# EAGLE design Input_v1.0 (EAGLE 9.6.1)

## Sheet 1 of 2
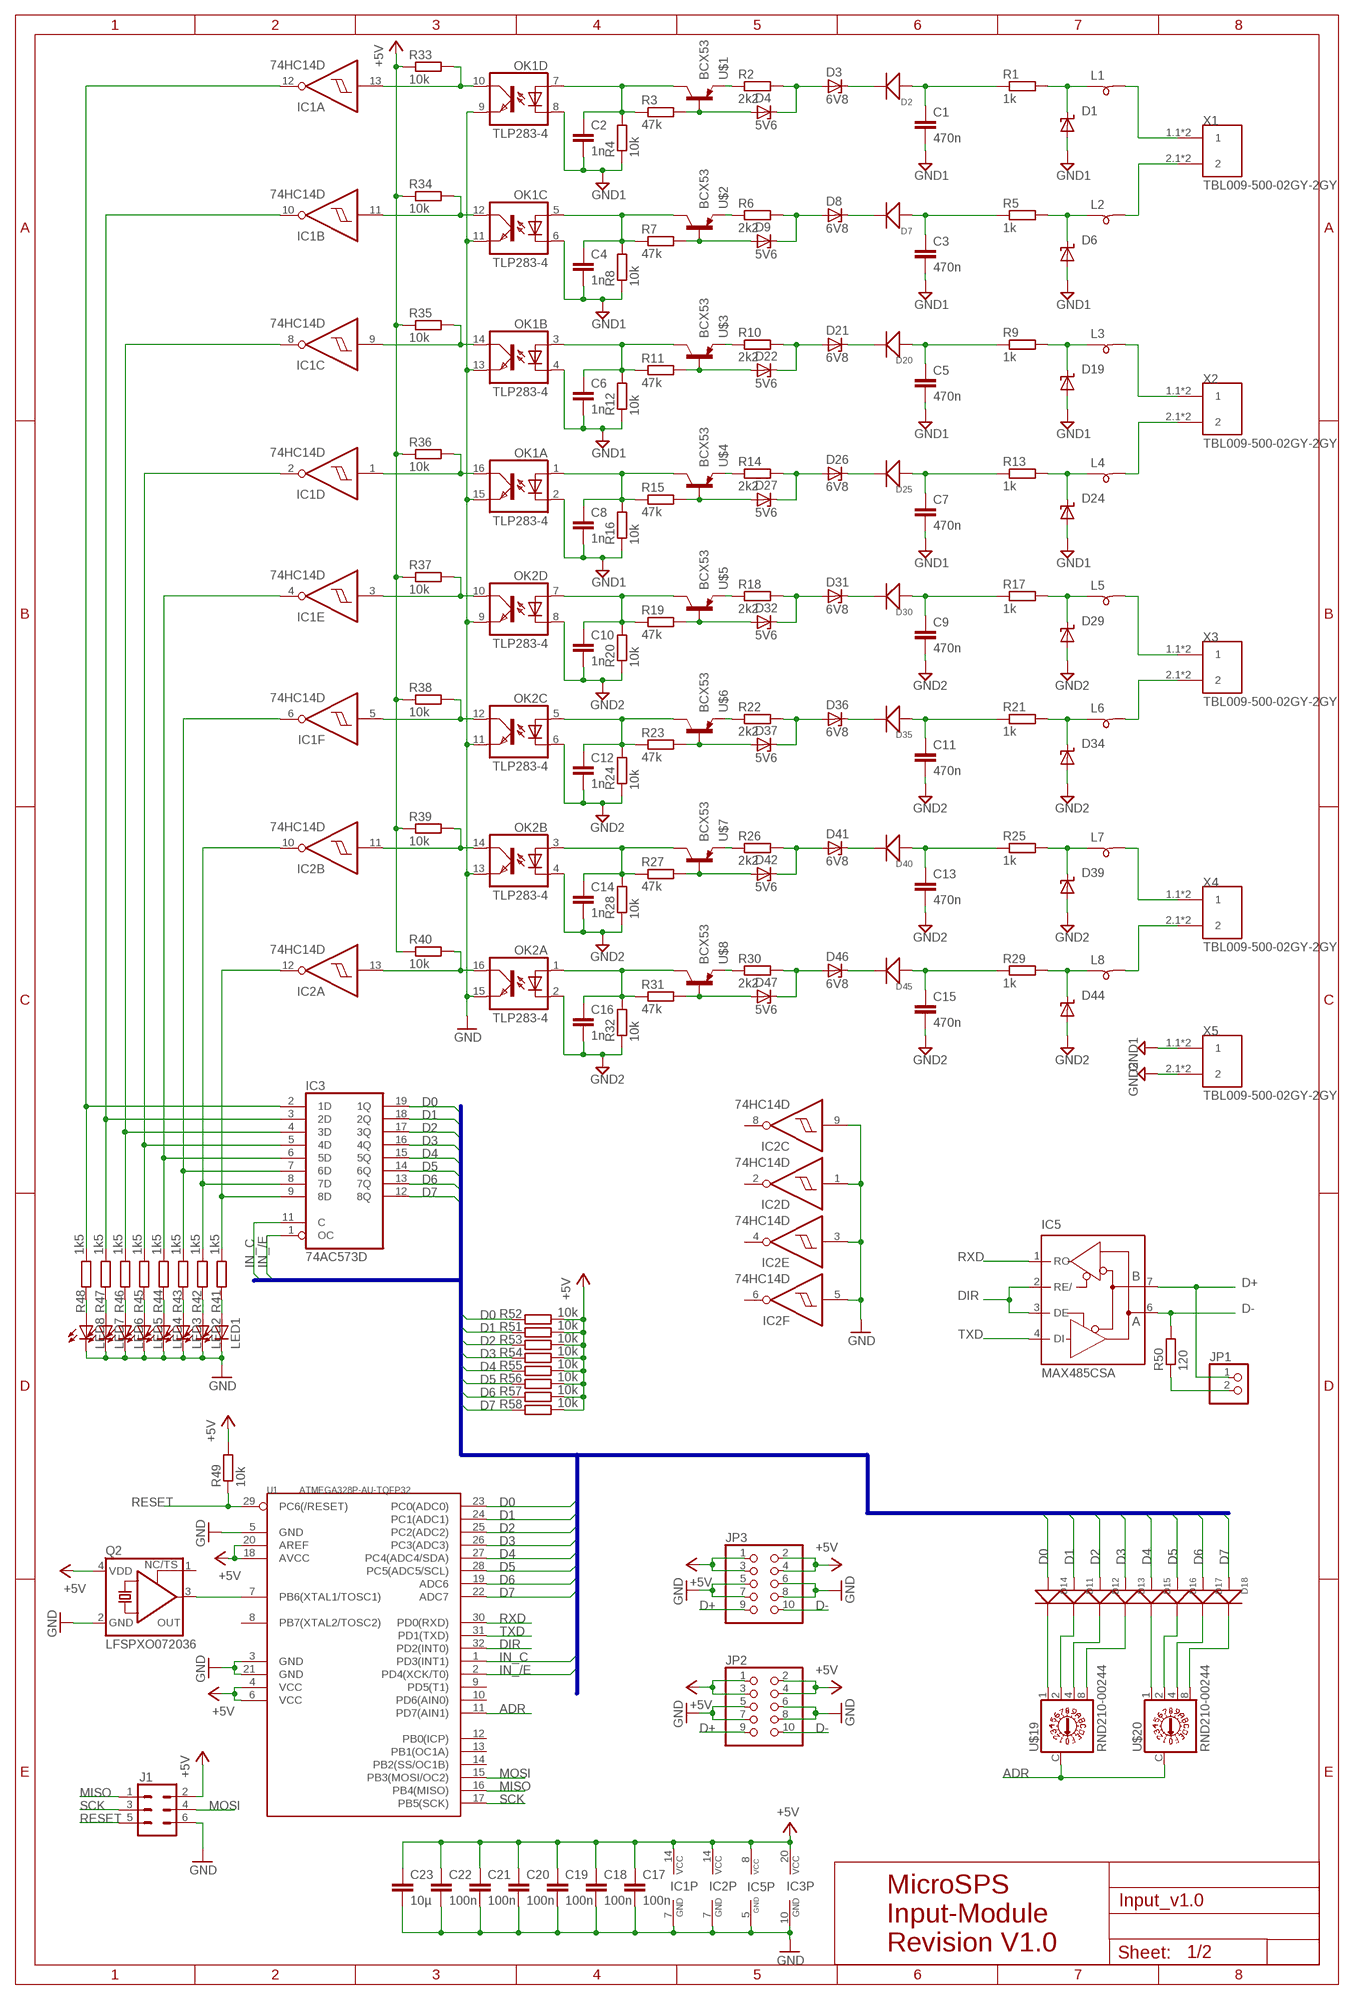
[diagram p0: schematic, sheet 1]

### Parts
C1  470n  C-EUC0805  [C0805]
C2  1n  C-EUC0805  [C0805]
C3  470n  C-EUC0805  [C0805]
C4  1n  C-EUC0805  [C0805]
C5  470n  C-EUC0805  [C0805]
C6  1n  C-EUC0805  [C0805]
C7  470n  C-EUC0805  [C0805]
C8  1n  C-EUC0805  [C0805]
C9  470n  C-EUC0805  [C0805]
C10  1n  C-EUC0805  [C0805]
C11  470n  C-EUC0805  [C0805]
C12  1n  C-EUC0805  [C0805]
C13  470n  C-EUC0805  [C0805]
C14  1n  C-EUC0805  [C0805]
C15  470n  C-EUC0805  [C0805]
C16  1n  C-EUC0805  [C0805]
C17  100n  C-EUC0805  [C0805]
C18  100n  C-EUC0805  [C0805]
C19  100n  C-EUC0805  [C0805]
C20  100n  C-EUC0805  [C0805]
C21  100n  C-EUC0805  [C0805]
C22  100n  C-EUC0805  [C0805]
C23  10µ  C-EUC0805  [C0805]
D1  SUPPRESSOR-SMBJ  [SMBJ]
D2  DIODE'1N4148-SMD'  [LL-34]
D3  6V8  ZENER-DIODESOD80C  [SOD80C]
D4  5V6  ZENER-DIODESOD80C  [SOD80C]
D6  SUPPRESSOR-SMBJ  [SMBJ]
D7  DIODE'1N4148-SMD'  [LL-34]
D8  6V8  ZENER-DIODESOD80C  [SOD80C]
D9  5V6  ZENER-DIODESOD80C  [SOD80C]
D11  DIODE'1N4148-SMD'  [LL-34]
D12  DIODE'1N4148-SMD'  [LL-34]
D13  DIODE'1N4148-SMD'  [LL-34]
D14  DIODE'1N4148-SMD'  [LL-34]
D15  DIODE'1N4148-SMD'  [LL-34]
D16  DIODE'1N4148-SMD'  [LL-34]
D17  DIODE'1N4148-SMD'  [LL-34]
D18  DIODE'1N4148-SMD'  [LL-34]
D19  SUPPRESSOR-SMBJ  [SMBJ]
D20  DIODE'1N4148-SMD'  [LL-34]
D21  6V8  ZENER-DIODESOD80C  [SOD80C]
D22  5V6  ZENER-DIODESOD80C  [SOD80C]
D24  SUPPRESSOR-SMBJ  [SMBJ]
D25  DIODE'1N4148-SMD'  [LL-34]
D26  6V8  ZENER-DIODESOD80C  [SOD80C]
D27  5V6  ZENER-DIODESOD80C  [SOD80C]
D29  SUPPRESSOR-SMBJ  [SMBJ]
D30  DIODE'1N4148-SMD'  [LL-34]
D31  6V8  ZENER-DIODESOD80C  [SOD80C]
D32  5V6  ZENER-DIODESOD80C  [SOD80C]
D34  SUPPRESSOR-SMBJ  [SMBJ]
D35  DIODE'1N4148-SMD'  [LL-34]
D36  6V8  ZENER-DIODESOD80C  [SOD80C]
D37  5V6  ZENER-DIODESOD80C  [SOD80C]
D39  SUPPRESSOR-SMBJ  [SMBJ]
D40  DIODE'1N4148-SMD'  [LL-34]
D41  6V8  ZENER-DIODESOD80C  [SOD80C]
D42  5V6  ZENER-DIODESOD80C  [SOD80C]
D44  SUPPRESSOR-SMBJ  [SMBJ]
D45  DIODE'1N4148-SMD'  [LL-34]
D46  6V8  ZENER-DIODESOD80C  [SOD80C]
D47  5V6  ZENER-DIODESOD80C  [SOD80C]
IC1  74HC14D  [SO14]
IC2  74HC14D  [SO14]
IC3  74AC573D  [SO20W]
IC5  MAX485CSA  MAX481CSA  [SO08]
J1  CONN_03X2FEMALE_SMD  [2X3_SMD]
JP1  PINHD-1X2  [1X02]
JP2  PINHD-2X5/90  [2X05/90]
JP3  PINHD-2X5/90  [2X05/90]
L1  SM-B5  [SM-B5]
L2  SM-B5  [SM-B5]
L3  SM-B5  [SM-B5]
L4  SM-B5  [SM-B5]
L5  SM-B5  [SM-B5]
L6  SM-B5  [SM-B5]
L7  SM-B5  [SM-B5]
L8  SM-B5  [SM-B5]
LED1  LED3MM  [LED3MM]
LED2  LED3MM  [LED3MM]
LED3  LED3MM  [LED3MM]
LED4  LED3MM  [LED3MM]
LED5  LED3MM  [LED3MM]
LED6  LED3MM  [LED3MM]
LED7  LED3MM  [LED3MM]
LED8  LED3MM  [LED3MM]
OK1  TLP283-4  [MINI-FLAT-16]
OK2  TLP283-4  [MINI-FLAT-16]
Q2  LFSPXO072036  KXO-PXO/XO-56-56  [5.0X3.2_KXO-56]
R1  1k  R-EU_R0805  [R0805]
R2  2k2  R-EU_R0805  [R0805]
R3  47k  R-EU_R0805  [R0805]
R4  10k  R-EU_R0805  [R0805]
R5  1k  R-EU_R0805  [R0805]
R6  2k2  R-EU_R0805  [R0805]
R7  47k  R-EU_R0805  [R0805]
R8  10k  R-EU_R0805  [R0805]
R9  1k  R-EU_R0805  [R0805]
R10  2k2  R-EU_R0805  [R0805]
R11  47k  R-EU_R0805  [R0805]
R12  10k  R-EU_R0805  [R0805]
R13  1k  R-EU_R0805  [R0805]
R14  2k2  R-EU_R0805  [R0805]
R15  47k  R-EU_R0805  [R0805]
R16  10k  R-EU_R0805  [R0805]
R17  1k  R-EU_R0805  [R0805]
R18  2k2  R-EU_R0805  [R0805]
R19  47k  R-EU_R0805  [R0805]
R20  10k  R-EU_R0805  [R0805]
R21  1k  R-EU_R0805  [R0805]
R22  2k2  R-EU_R0805  [R0805]
R23  47k  R-EU_R0805  [R0805]
R24  10k  R-EU_R0805  [R0805]
R25  1k  R-EU_R0805  [R0805]
R26  2k2  R-EU_R0805  [R0805]
R27  47k  R-EU_R0805  [R0805]
R28  10k  R-EU_R0805  [R0805]
R29  1k  R-EU_R0805  [R0805]
R30  2k2  R-EU_R0805  [R0805]
R31  47k  R-EU_R0805  [R0805]
R32  10k  R-EU_R0805  [R0805]
R33  10k  R-EU_R0805  [R0805]
R34  10k  R-EU_R0805  [R0805]
R35  10k  R-EU_R0805  [R0805]
R36  10k  R-EU_R0805  [R0805]
R37  10k  R-EU_R0805  [R0805]
R38  10k  R-EU_R0805  [R0805]
R39  10k  R-EU_R0805  [R0805]
R40  10k  R-EU_R0805  [R0805]
R41  1k5  R-EU_R0805  [R0805]
R42  1k5  R-EU_R0805  [R0805]
R43  1k5  R-EU_R0805  [R0805]
R44  1k5  R-EU_R0805  [R0805]
R45  1k5  R-EU_R0805  [R0805]
R46  1k5  R-EU_R0805  [R0805]
R47  1k5  R-EU_R0805  [R0805]
R48  1k5  R-EU_R0805  [R0805]
R49  10k  R-EU_R0805  [R0805]
R50  120  R-EU_R0805  [R0805]
R51  10k  R-EU_R0805  [R0805]
R52  10k  R-EU_R0805  [R0805]
R53  10k  R-EU_R0805  [R0805]
R54  10k  R-EU_R0805  [R0805]
R55  10k  R-EU_R0805  [R0805]
R56  10k  R-EU_R0805  [R0805]
R57  10k  R-EU_R0805  [R0805]
R58  10k  R-EU_R0805  [R0805]
U1  ATMEGA328P-AU-TQFP32  MCU-ATMEGA328P-AU(TQFP32)  [TQFP32-0.8-7X7MM]
U$1  BCX53  [SOT89]
U$2  BCX53  [SOT89]
U$3  BCX53  [SOT89]
U$4  BCX53  [SOT89]
U$5  BCX53  [SOT89]
U$6  BCX53  [SOT89]
U$7  BCX53  [SOT89]
U$8  BCX53  [SOT89]
U$19  RND210-00244  [RND210-00244]
U$20  RND210-00244  [RND210-00244]
X1  TBL009-500-02GY-2GY  [TBL009-500-02GY-2GY]
X2  TBL009-500-02GY-2GY  [TBL009-500-02GY-2GY]
X3  TBL009-500-02GY-2GY  [TBL009-500-02GY-2GY]
X4  TBL009-500-02GY-2GY  [TBL009-500-02GY-2GY]
X5  TBL009-500-02GY-2GY  [TBL009-500-02GY-2GY]

### Nets
+5V: C17.1 C18.1 C19.1 C20.1 C21.1 C22.1 C23.1 IC1.14(P:VCC) IC2.14(P:VCC) IC3.20(VCC) IC5.8(VCC) J1.2 JP2.1 JP2.2 JP2.3 JP2.4 JP3.1 JP3.2 JP3.3 JP3.4 Q2.4(VDD) R33.1 R34.1 R35.1 R36.1 R37.1 R38.1 R39.1 R40.1 R49.2 R51.2 R52.2 R53.2 R54.2 R55.2 R56.2 R57.2 R58.2 U1.4(VCC) U1.6(VCC) U1.18(AVCC) U1.20(AREF)
ADR: U1.11(PD7(AIN1)) U$19.C U$20.C
D0: D14.A(+) IC3.19(1Q) R52.1 U1.23(PC0(ADC0))
D1: D11.A(+) IC3.18(2Q) R51.1 U1.24(PC1(ADC1))
D2: D12.A(+) IC3.17(3Q) R53.1 U1.25(PC2(ADC2))
D3: D13.A(+) IC3.16(4Q) R54.1 U1.26(PC3(ADC3))
D4: D15.A(+) IC3.15(5Q) R55.1 U1.27(PC4(ADC4/SDA))
D5: D16.A(+) IC3.14(6Q) R56.1 U1.28(PC5(ADC5/SCL))
D6: D17.A(+) IC3.13(7Q) R57.1 U1.19(ADC6)
D7: D18.A(+) IC3.12(8Q) R58.1 U1.22(ADC7)
D+: IC5.7(B) JP1.1 JP2.9 JP3.9
D-: IC5.6(A) JP2.10 JP3.10 R50.2
DIR: IC5.2(RE/) IC5.3(DE) U1.32(PD2(INT0))
GND: C17.2 C18.2 C19.2 C20.2 C21.2 C22.2 C23.2 IC1.7(P:GND) IC2.1(D:I) IC2.3(E:I) IC2.5(F:I) IC2.7(P:GND) IC2.9(C:I) IC3.10(GND) IC5.5(GND) J1.6 JP2.5 JP2.6 JP2.7 JP2.8 JP3.5 JP3.6 JP3.7 JP3.8 LED1.K(C) LED2.K(C) LED3.K(C) LED4.K(C) LED5.K(C) LED6.K(C) LED7.K(C) LED8.K(C) OK1.9(D:EMIT) OK1.11(C:EMIT) OK1.13(B:EMIT) OK1.15(A:EMIT) OK2.9(D:EMIT) OK2.11(C:EMIT) OK2.13(B:EMIT) OK2.15(A:EMIT) Q2.2(GND) U1.3(GND) U1.5(GND) U1.21(GND)
GND1: C1.2 C2.2 C3.2 C4.2 C5.2 C6.2 C7.2 C8.2 D1.A D6.A D19.A D24.A OK1.2(A:C) OK1.4(B:C) OK1.6(C:C) OK1.8(D:C) R4.1 R8.1 R12.1 R16.1 X5.1.1 X5.1.2
GND2: C9.2 C10.2 C11.2 C12.2 C13.2 C14.2 C15.2 C16.2 D29.A D34.A D39.A D44.A OK2.2(A:C) OK2.4(B:C) OK2.6(C:C) OK2.8(D:C) R20.1 R24.1 R28.1 R32.1 X5.2.1 X5.2.2
IN_/E: IC3.1(OC) U1.2(PD4(XCK/T0))
IN_C: IC3.11(C) U1.1(PD3(INT1))
MISO: J1.1 U1.16(PB4(MISO))
MOSI: J1.4 U1.15(PB3(MOSI/OC2))
N$1: D3.A D4.C R2.2
N$2: D2.C(-) D3.C
N$3: C1.1 D2.A(+) R1.1
N$4: D1.C L1.1 R1.2
N$5: D4.A R3.2 U$1.1(B)
N$6: R2.1 U$1.3(E)
N$7: C2.1 OK1.7(D:A) R3.1 R4.2 U$1.2(C) U$1.2.1(C)
N$8: IC1.13(A:I) OK1.10(D:COL) R33.2
N$9: L1.2 X1.1.1 X1.1.2
N$10: D8.A D9.C R6.2
N$11: D7.C(-) D8.C
N$12: C3.1 D7.A(+) R5.1
N$13: D6.C L2.1 R5.2
N$14: R6.1 U$2.3(E)
N$15: L2.2 X1.2.1 X1.2.2
N$16: D9.A R7.2 U$2.1(B)
N$17: C4.1 OK1.5(C:A) R7.1 R8.2 U$2.2(C) U$2.2.1(C)
N$18: IC1.11(B:I) OK1.12(C:COL) R34.2
N$19: D21.A D22.C R10.2
N$20: D20.C(-) D21.C
N$21: C5.1 D20.A(+) R9.1
N$22: D19.C L3.1 R9.2
N$23: R10.1 U$3.3(E)
N$24: L3.2 X2.1.1 X2.1.2
N$25: D22.A R11.2 U$3.1(B)
N$26: C6.1 OK1.3(B:A) R11.1 R12.2 U$3.2(C) U$3.2.1(C)
N$27: IC1.9(C:I) OK1.14(B:COL) R35.2
N$28: D26.A D27.C R14.2
N$29: D25.C(-) D26.C
N$30: C7.1 D25.A(+) R13.1
N$31: D24.C L4.1 R13.2
N$32: R14.1 U$4.3(E)
N$33: L4.2 X2.2.1 X2.2.2
N$34: D27.A R15.2 U$4.1(B)
N$35: C8.1 OK1.1(A:A) R15.1 R16.2 U$4.2(C) U$4.2.1(C)
N$36: IC1.1(D:I) OK1.16(A:COL) R36.2
N$37: D31.A D32.C R18.2
N$38: D30.C(-) D31.C
N$39: C9.1 D30.A(+) R17.1
N$40: D29.C L5.1 R17.2
N$41: R18.1 U$5.3(E)
N$42: L5.2 X3.1.1 X3.1.2
N$43: D32.A R19.2 U$5.1(B)
N$44: C10.1 OK2.7(D:A) R19.1 R20.2 U$5.2(C) U$5.2.1(C)
N$45: IC1.3(E:I) OK2.10(D:COL) R37.2
N$46: D36.A D37.C R22.2
N$47: D35.C(-) D36.C
N$48: C11.1 D35.A(+) R21.1
N$49: D34.C L6.1 R21.2
N$50: R22.1 U$6.3(E)
N$51: L6.2 X3.2.1 X3.2.2
N$52: D37.A R23.2 U$6.1(B)
N$53: C12.1 OK2.5(C:A) R23.1 R24.2 U$6.2(C) U$6.2.1(C)
N$54: IC1.5(F:I) OK2.12(C:COL) R38.2
N$55: D41.A D42.C R26.2
N$56: D40.C(-) D41.C
N$57: C13.1 D40.A(+) R25.1
N$58: D39.C L7.1 R25.2
N$59: R26.1 U$7.3(E)
N$60: L7.2 X4.1.1 X4.1.2
N$61: D42.A R27.2 U$7.1(B)
N$62: C14.1 OK2.3(B:A) R27.1 R28.2 U$7.2(C) U$7.2.1(C)
N$63: IC2.11(B:I) OK2.14(B:COL) R39.2
N$64: D46.A D47.C R30.2
N$65: D45.C(-) D46.C
N$66: C15.1 D45.A(+) R29.1
N$67: D44.C L8.1 R29.2
N$68: R30.1 U$8.3(E)
N$69: L8.2 X4.2.1 X4.2.2
N$70: D47.A R31.2 U$8.1(B)
N$71: C16.1 OK2.1(A:A) R31.1 R32.2 U$8.2(C) U$8.2.1(C)
N$72: IC2.13(A:I) OK2.16(A:COL) R40.2
N$73: IC1.12(A:O) IC3.2(1D) R48.2
N$74: IC1.10(B:O) IC3.3(2D) R47.2
N$75: IC1.8(C:O) IC3.4(3D) R46.2
N$76: IC1.2(D:O) IC3.5(4D) R45.2
N$77: IC1.4(E:O) IC3.6(5D) R44.2
N$78: IC1.6(F:O) IC3.7(6D) R43.2
N$79: IC2.10(B:O) IC3.8(7D) R42.2
N$80: IC2.12(A:O) IC3.9(8D) R41.2
N$81: LED8.A R48.1
N$82: LED7.A R47.1
N$83: LED6.A R46.1
N$84: LED5.A R45.1
N$85: LED4.A R44.1
N$86: LED3.A R43.1
N$87: LED2.A R42.1
N$88: LED1.A R41.1
N$97: Q2.3(OUT) U1.7(PB6(XTAL1/TOSC1))
N$99: JP1.2 R50.1
N$100: D14.C(-) U$19.1
N$101: D11.C(-) U$19.2
N$102: D12.C(-) U$19.4
N$103: D13.C(-) U$19.8
N$104: D15.C(-) U$20.1
N$105: D16.C(-) U$20.2
N$106: D17.C(-) U$20.4
N$107: D18.C(-) U$20.8
RESET: J1.5 R49.1 U1.29(PC6(/RESET))
RXD: IC5.1(RO) U1.30(PD0(RXD))
SCK: J1.3 U1.17(PB5(SCK))
TXD: IC5.4(DI) U1.31(PD1(TXD))
Unconnected: IC2.2(D:O) IC2.4(E:O) IC2.6(F:O) IC2.8(C:O) Q2.1(TS) U1.8(PB7(XTAL2/TOSC2)) U1.9(PD5(T1)) U1.10(PD6(AIN0)) U1.12(PB0(ICP)) U1.13(PB1(OC1A)) U1.14(PB2(SS/OC1B))

### Buses
D0,D1,D2,D3,D4,D5,D6,D7,IN_C,IN_/E

### Notes on the sheet
- MicroSPS
  Input-Module
  Revision V1.0

## Sheet 2 of 2

## Library data of the parts
C1-C23 = rcl:C-EU: CAPACITOR, European symbol; SPICEPREFIX: C
D1 D6 D19 D24 D29 D34 D39 D44 = diode:SUPPRESSOR-: Suppressor diode
D2 D7 D11-D18 D20 D25 D30 D35 D40 D45 = Seeed-OPL-Diode:DIODE*
D3 D4 D8 D9 D21 D22 D26 D27 D31 D32 D36 D37 D41 D42 D46 D47 = diode:ZENER-DIODE: Z-Diode
IC1 IC2 = 74xx-eu:74*14: Hex schmitt trigger INVERTER
IC3 = 74xx-eu:74*573: 8-bit D latch BUS DRIVER
IC5 = maxim:MAX481CSA: RS485 TRANSEIVER; MF: MAXIM; MPN: MAX481CSA; OC_FARNELL: unknown; OC_NEWARK: 90C3817
J1 = SparkFun-Connectors:CONN_03X2: Multi connection point. Often used as Generic Header-pin footprint for 0.1 inch spaced/style header connections You can populate with any combo of single row headers, but if you'd like an exact match, check these: Header - 2x3 (Male, 0.1") <https://www.sparkfun.com/products/12807> (PRT-12807) Header - 2x3 (Female, 0.1") <https://www.sparkfun.com/products/13010> (PRT-13010) 2x3 Pin Shrouded Header <https://www.sparkfun.com/products/10877> (PRT-10877) On any of the 0.1 inch spaced packages, you can populate with these: Break Away Headers - Straight <https://www.sparkfun.com/products/116> (PRT-00116) Break Away Male Headers - Right Angle <https://www.sparkfun.com/products/553> (PRT-00553) Female Headers <https://www.sparkfun.com/products/115> (PRT-00115) Break Away Headers - Machine Pin <https://www.sparkfun.com/products/117> (PRT-00117) Break Away Female Headers - Swiss Machine Pin <https://www.sparkfun.com/products/743> (PRT-00743) Special note: the shrouded connector mates well with our 3x2 ribbon cables: Ribbon Crimp Connector - 6-pin (2x3, Female) <https://www.sparkfun.com/products/10651> (PRT-10651) Ribbon Cable - 6 wire (15ft) <https://www.sparkfun.com/products/10646> (PRT-10646); PROD_ID: CONN-11290
JP1 = pinhead:PINHD-1X2: PIN HEADER
JP2 JP3 = pinhead:PINHD-2X5: PIN HEADER
L1-L8 = inductor-neosid:SM-B: INDUCTOR SMD Bead inductor; OC_FARNELL: unknown; OC_NEWARK: unknown
LED1-LED8 = led:LED: LED OSRAM: - CHIPLED LG R971, LG N971, LY N971, LG Q971, LY Q971, LO R971, LY R971 LH N974, LH R974 LS Q976, LO Q976, LY Q976 LO Q996 - Hyper CHIPLED LW Q18S LB Q993, LB Q99A, LB R99A - SideLED LS A670, LO A670, LY A670, LG A670, LP A670 LB A673, LV A673, LT A673, LW A673 LH A674 LY A675 LS A676, LA A676, LO A676, LY A676, LW A676 LS A679, LY A679, LG A679 - Hyper Micro SIDELED® LS Y876, LA Y876, LO Y876, LY Y876 LT Y87S - SmartLED LW L88C, LW L88S LB L89C, LB L89S, LG L890 LS L89K, LO L89K, LY L89K LS L896, LA L896, LO L896, LY L896 - TOPLED LS T670, LO T670, LY T670, LG T670, LP T670 LSG T670, LSP T670, LSY T670, LOP T670, LYG T670 LG T671, LOG T671, LSG T671 LB T673, LV T673, LT T673, LW T673 LH T674 LS T676, LA T676, LO T676, LY T676, LB T676, LH T676, LSB T676, LW T676 LB T67C, LV T67C, LT T67C, LS T67K, LO T67K, LY T67K, LW E67C LS E67B, LA E67B, LO E67B, LY E67B, LB E67C, LV E67C, LT E67C LW T67C LS T679, LY T679, LG T679 LS T770, LO T770, LY T770, LG T770, LP T770 LB T773, LV T773, LT T773, LW T773 LH T774 LS E675, LA E675, LY E675, LS T675 LS T776, LA T776, LO T776, LY T776, LB T776 LHGB T686 LT T68C, LB T68C - Hyper Mini TOPLED® LB M676 - Mini TOPLED Santana® LG M470 LS M47K, LO M47K, LY M47K Source: http://www.osram.convergy.de LUXEON: - LUMILED® LXK2-PW12-R00, LXK2-PW12-S00, LXK2-PW14-U00, LXK2-PW14-V00 LXK2-PM12-R00, LXK2-PM12-S00, LXK2-PM14-U00 LXK2-PE12-Q00, LXK2-PE12-R00, LXK2-PE12-S00, LXK2-PE14-T00, LXK2-PE14-U00 LXK2-PB12-K00, LXK2-PB12-L00, LXK2-PB12-M00, LXK2-PB14-N00, LXK2-PB14-P00, LXK2-PB14-Q00 LXK2-PR12-L00, LXK2-PR12-M00, LXK2-PR14-Q00, LXK2-PR14-R00 LXK2-PD12-Q00, LXK2-PD12-R00, LXK2-PD12-S00 LXK2-PH12-R00, LXK2-PH12-S00 LXK2-PL12-P00, LXK2-PL12-Q00, LXK2-PL12-R00 Source: www.luxeon.com KINGBRIGHT: KA-3528ASYC Source: www.kingbright.com
OK1 OK2 = optocoupler:TLP283-4: TOSHIBA PHOTOCOUPLER GaAs IRED & PHOTO-TRANSISTOR Source: http://www.semicon.toshiba.co.jp/td/en/Opto/Photocoupler/en_20050928_TLP283_datasheet.pdf; OC_FARNELL: unknown; OC_NEWARK: unknown
Q2 = crystal-geyer_V1_0:KXO-PXO/XO-56: SSO Spread Spectrum Oscillator (PXO/XO) MHz : KXO - Serie Model Size l/w/h [mm] Frequency Range Frequency Stability Temp. Range [°C] Output AECQ 200 availabel Datasheet KXO-56 5.0/3.2/1.2 1,0 ~ 134,0 MHz ±25 … ±100ppm (*) -40°C …+85°C HCMOS - KXO-56.pdf <http://www.geyer-electronic.de/uploads/tx_userartikelfrequenz/GEYER-KXO-56.pdf> <http://www.geyer-electronic.de/fileadmin/template/img/logo-geyer-electronic.png> Details see: http://www.geyer-electronic.de/Frequenz-Produkte.9.0.html Created 2016-06-07, Hans Locher 2016 (C) Geyer Quartz Technology KXO56;5,0x3,2;5.0x3.2;5032
R1-R58 = rcl:R-EU_: RESISTOR, European symbol; SPICEPREFIX: R
U1 = Seeed-OPL-ic:MCU-ATMEGA328P-AU(TQFP32): 310010049; MPN: ATMEGA328P-AU
U$1-U$8 = transistor-pnp:BCX53
U$19 U$20 = switch-dil:RND210-00244
X1-X5 = con-phoenix-500:TBL009-500-02GY-2GY

## Board
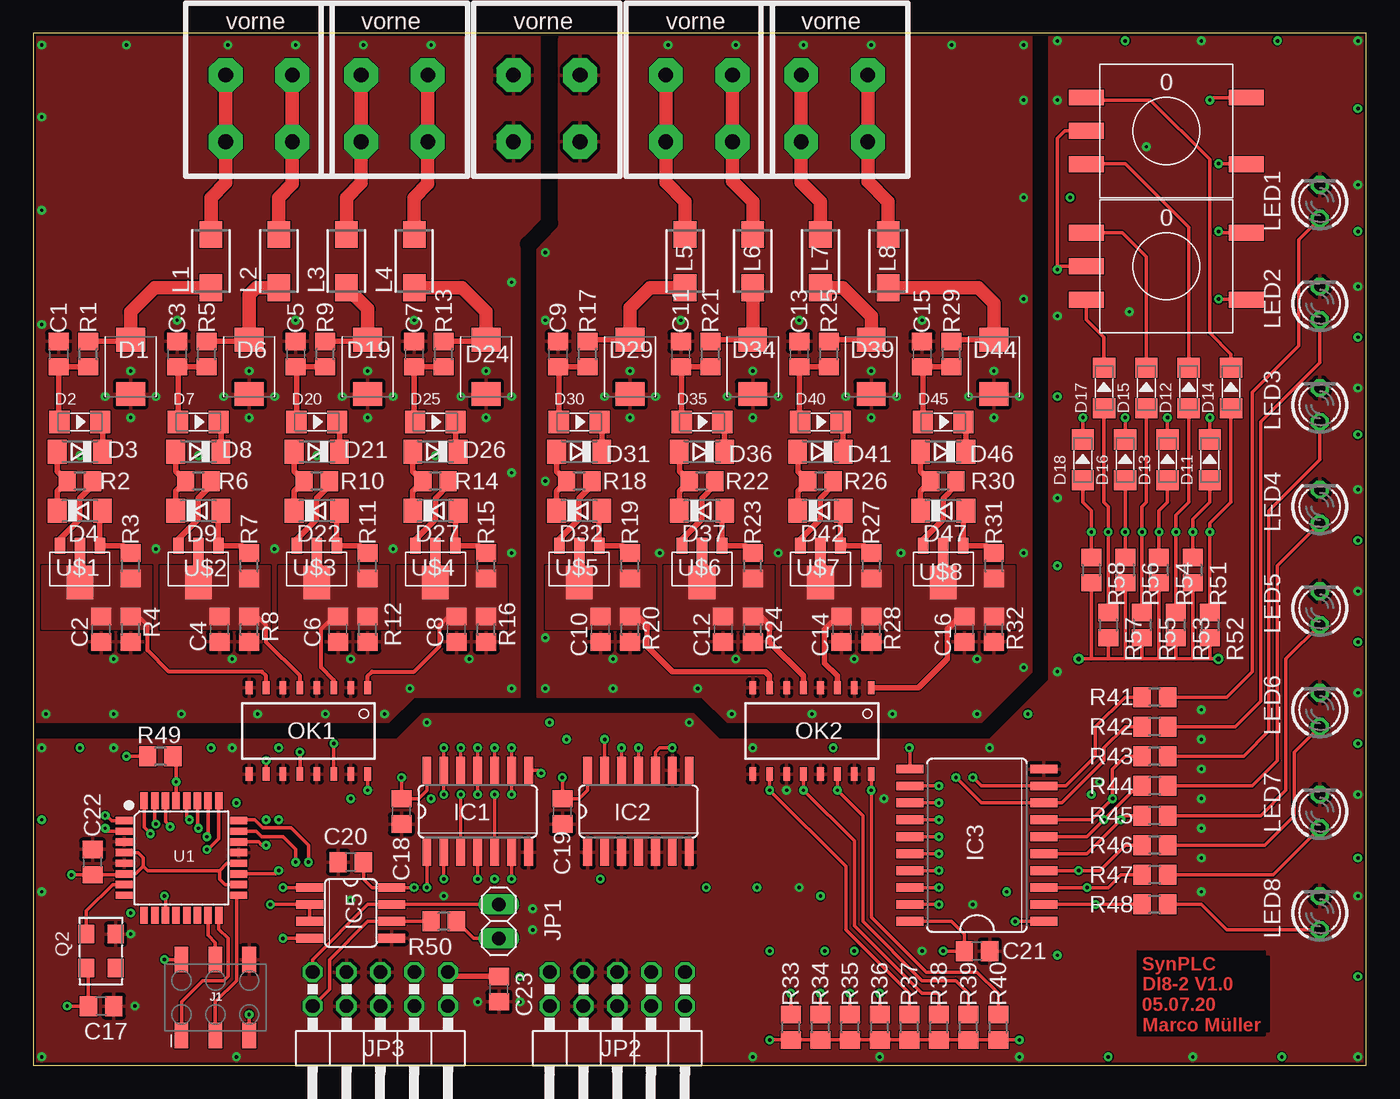
[diagram p1: board, top side]
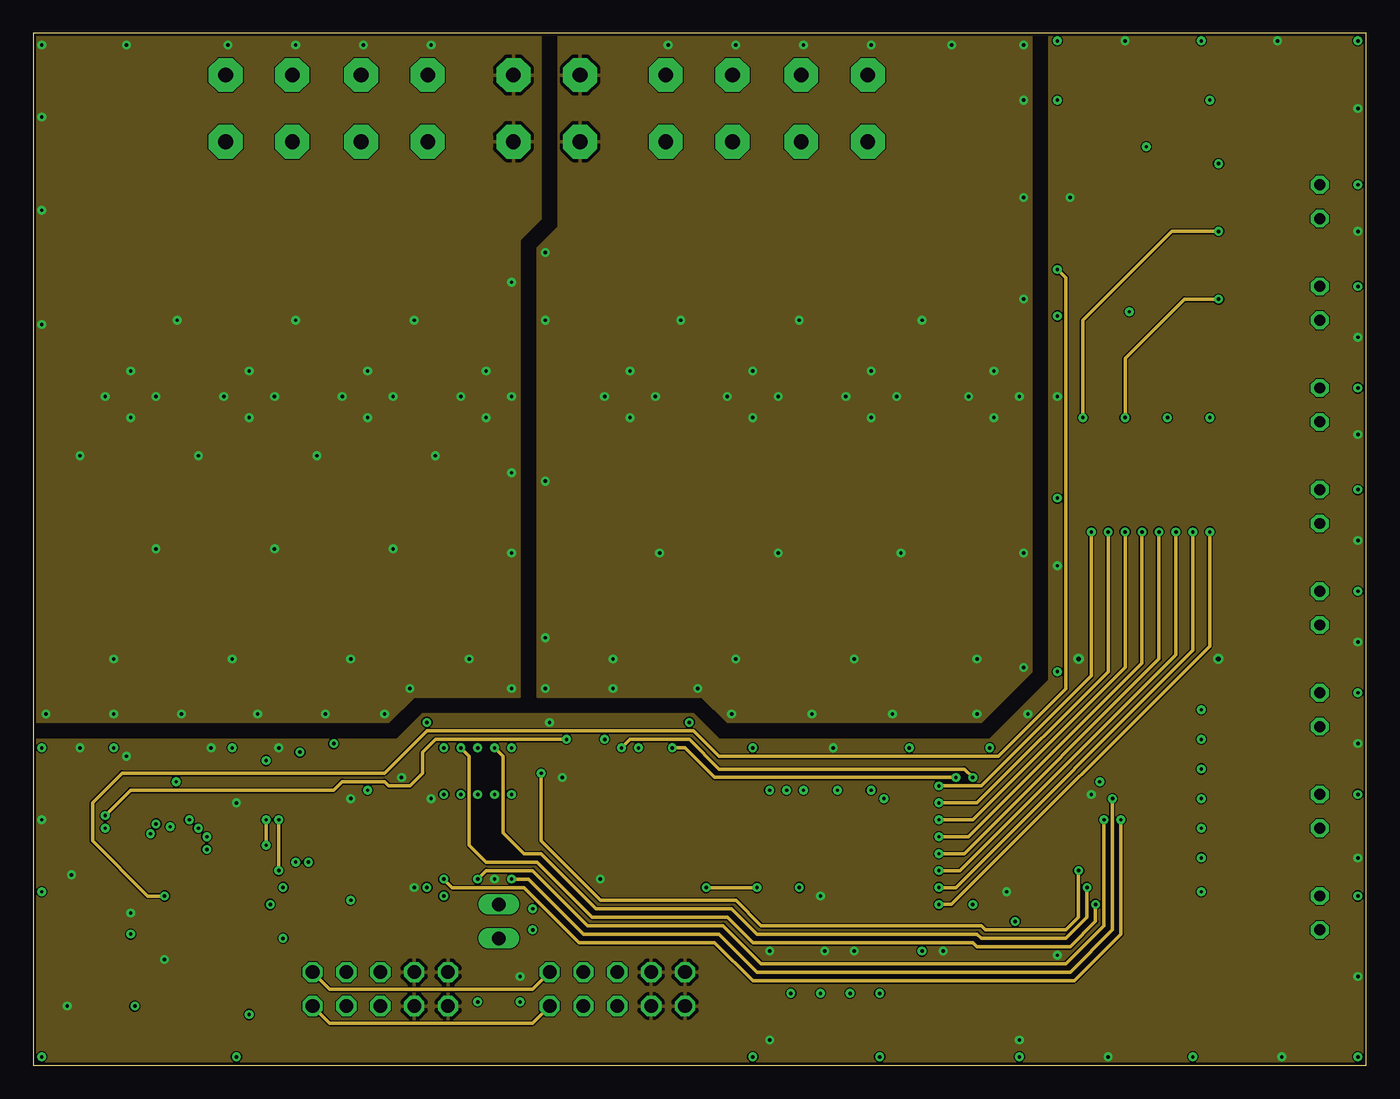
[diagram p2: board, inner layer Route2]
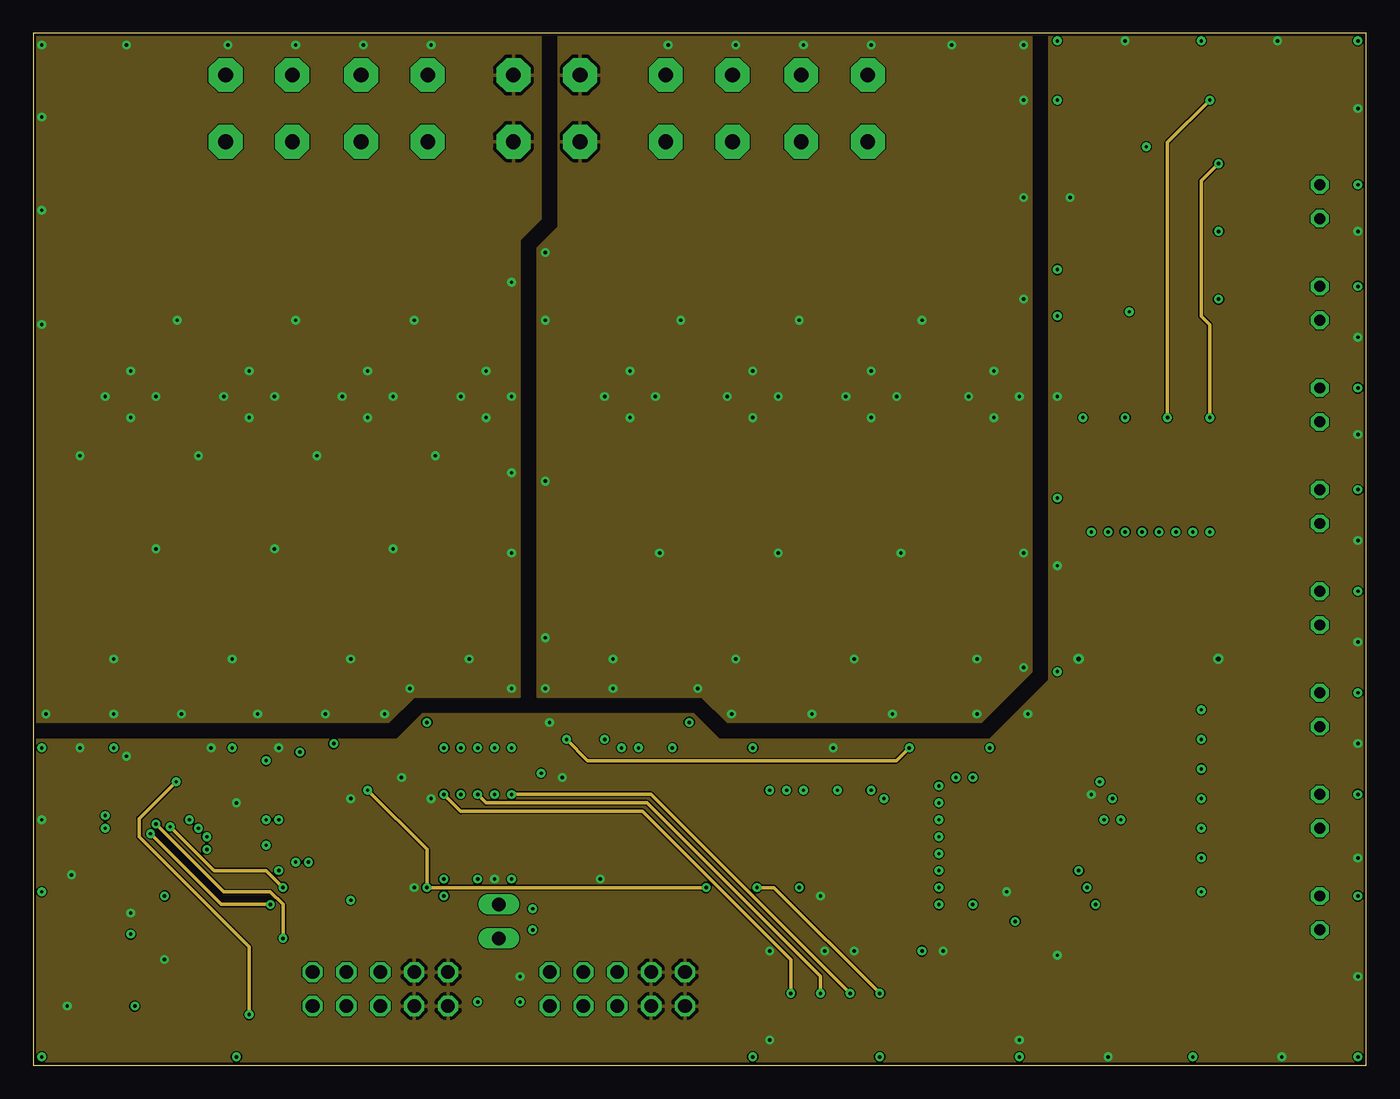
[diagram p3: board, inner layer Route15]
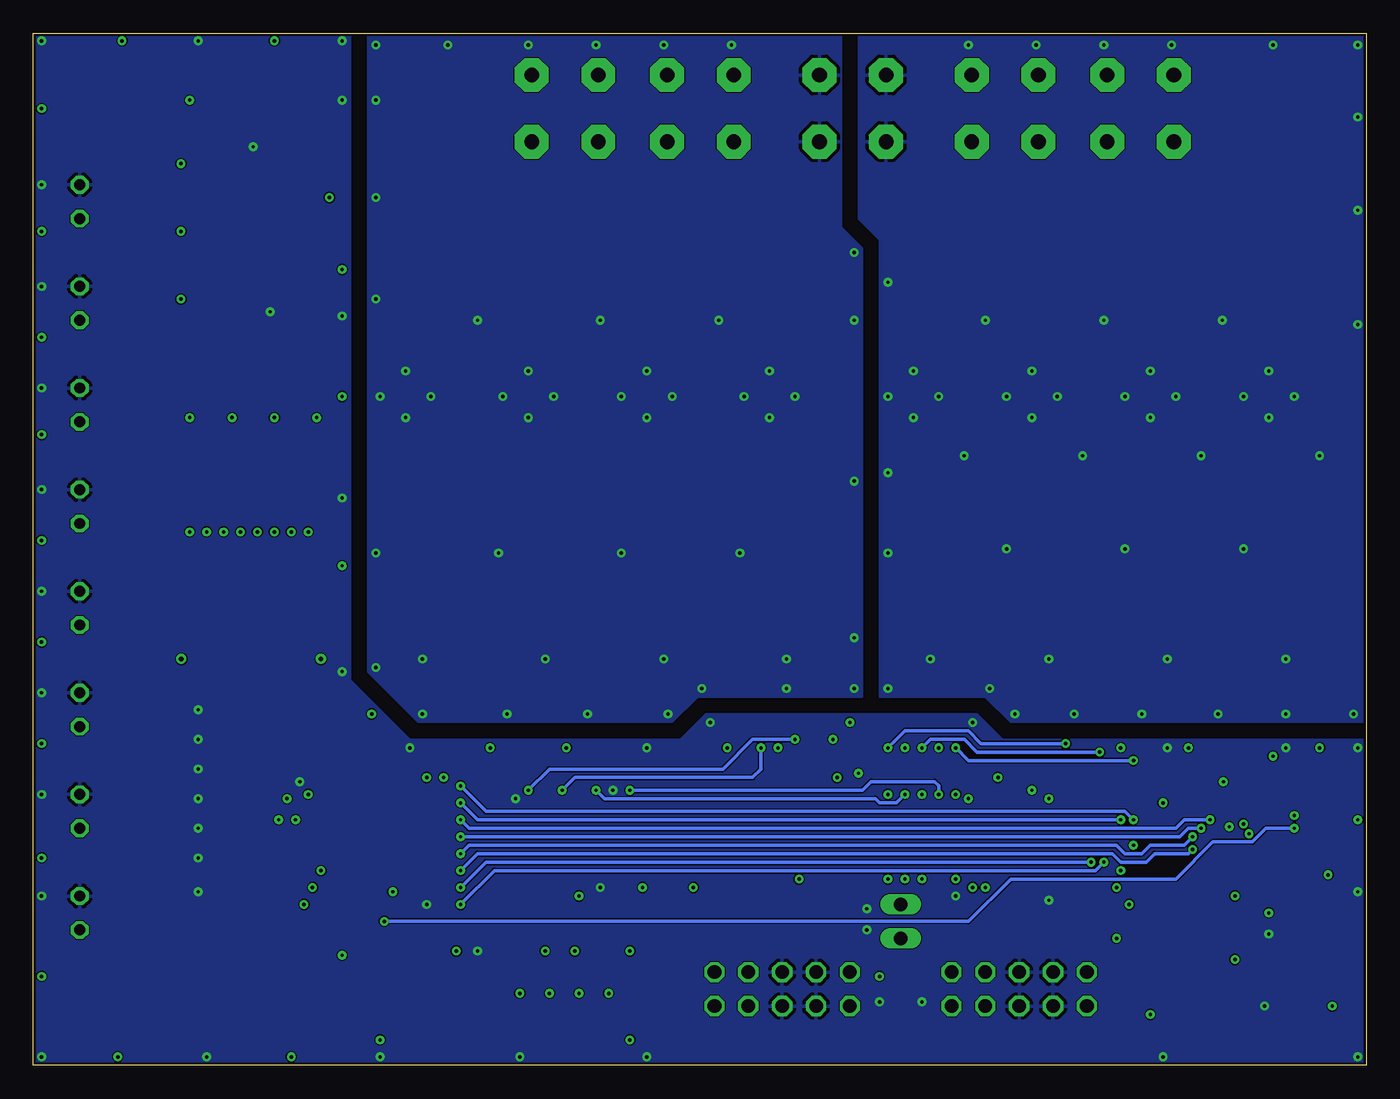
[diagram p4: board, bottom side, seen from below]

Size 100 x 77.4 mm. Coordinates in mm from the lower left corner, seen from the top.
Outline: 0,0 100,0 100,77.4 0,77.4 0,0
Copper layers (1+2*15+16): Top 0.035mm / dielectric 0.2mm / Route2 0.035mm / dielectric 1mm / Route15 0.035mm / dielectric 0.2mm / Bottom 0.035mm
Design rules "jlc *": minimum track width 3.5mil, minimum drill 0.2mm, track to track 3.5mil, track to pad 6mil, pad to pad 6mil, via to via 6mil, smd to smd 6mil, copper to edge 0.2mm, drill to drill 6mil, minimum pad ring 10mil, minimum via ring 8mil, stop-mask expansion 4mil, vias tented up to drill 0mil, thermal gap 10mil
tRestrict: 15 lines

### Footprints (pad centres in the part's own frame; a part is rotated, then mirrored left to right if it is on the bottom)
C0805 = smd 1.3 x 1.5: 1 -0.95,0; 2 0.95,0
SMBJ = smd 1.78 x 2.16: A 2.04,0; C -2.03,0
LL-34 = smd 1.524 x 1.676: A -1.524,0; C 1.524,0
SOD80C = smd 1.4 x 1.8: A 1.7,0; C -1.7,0
SO14 = smd 0.66 x 2.032: 1 -3.81,-3.073; 2 -2.54,-3.073; 3 -1.27,-3.073; 4 0,-3.073; 5 1.27,-3.073; 6 2.54,-3.073; 7 3.81,-3.073; 8 3.81,3.073; 9 2.54,3.073; 10 1.27,3.073; 11 0,3.073; 12 -1.27,3.073; 13 -2.54,3.073; 14 -3.81,3.073
SO20W = smd 0.66 x 2.032: 1 -5.715,-5.029; 2 -4.445,-5.029; 3 -3.175,-5.029; 4 -1.905,-5.029; 5 -0.635,-5.029; 6 0.635,-5.029; 7 1.905,-5.029; 8 3.175,-5.029; 9 4.445,-5.029; 10 5.715,-5.029; 11 5.715,5.029; 12 4.445,5.029; 13 3.175,5.029; 14 1.905,5.029; 15 0.635,5.029; 16 -0.635,5.029; 17 -1.905,5.029; 18 -3.175,5.029; 19 -4.445,5.029; 20 -5.715,5.029
SO08 = smd 0.66 x 2.032: 1 -1.905,-3.073; 2 -0.635,-3.073; 3 0.635,-3.073; 4 1.905,-3.073; 5 1.905,3.073; 6 0.635,3.073; 7 -0.635,3.073; 8 -1.905,3.073
2X3_SMD = smd 1.02 x 1.9: 1 -2.54,-2.85; 2 -2.54,2.85; 3 0,-2.85; 4 0,2.85; 5 2.54,-2.85; 6 2.54,2.85
1X02 = drill 1.016 long: 1 -1.27,0; 2 1.27,0
2X05/90 = drill 1.016 octagon: 1 -5.08,-6.35; 2 -5.08,-3.81; 3 -2.54,-6.35; 4 -2.54,-3.81; 5 0,-6.35; 6 0,-3.81; 7 2.54,-6.35; 8 2.54,-3.81; 9 5.08,-6.35; 10 5.08,-3.81
SM-B5 = smd 2 x 1.7: 1 -2,0; 2 2,0
LED3MM = drill 0.813 octagon: A -1.27,0; K 1.27,0
MINI-FLAT-16 = smd 1 x 0.5: 1 -3.24,4.445; 2 -3.24,3.175; 3 -3.24,1.905; 4 -3.24,0.635; 5 -3.24,-0.635; 6 -3.24,-1.905; 7 -3.24,-3.175; 8 -3.24,-4.445; 9 3.24,-4.445; 10 3.24,-3.175; 11 3.24,-1.905; 12 3.24,-0.635; 13 3.24,0.635; 14 3.24,1.905; 15 3.24,3.175; 16 3.24,4.445
5.0X3.2_KXO-56 = smd 1.4 x 1.2: 1 -1.27,-1.1; 2 1.27,-1.1; 3 1.27,1.1; 4 -1.27,1.1
R0805 = smd 1.3 x 1.5: 1 -0.95,0; 2 0.95,0
TQFP32-0.8-7X7MM = smd 1.27 x 0.559: 1 -4.293,2.8; 2 -4.293,2; 3 -4.293,1.2; 4 -4.293,0.4; 5 -4.293,-0.4; 6 -4.293,-1.2; 7 -4.293,-2; 8 -4.293,-2.8; 17 4.293,-2.8; 18 4.293,-2; 19 4.293,-1.2; 20 4.293,-0.4; 21 4.293,0.4; 22 4.293,1.2; 23 4.293,2; 24 4.293,2.8 | smd 0.559 x 1.27: 9 -2.8,-4.293; 10 -2,-4.293; 11 -1.2,-4.293; 12 -0.4,-4.293; 13 0.4,-4.293; 14 1.2,-4.293; 15 2,-4.293; 16 2.8,-4.293; 25 2.8,4.293; 26 2,4.293; 27 1.2,4.293; 28 0.4,4.293; 29 -0.4,4.293; 30 -1.2,4.293; 31 -2,4.293; 32 -2.8,4.293
SOT89 = smd 0.8 x 1.2: 1 -1.5,-1.5; 3 1.5,-1.5 | smd 0.8 x 2.2: 2 0,-1 | smd 2 x 2.5: 2.1 0,1.25
RND210-00244 = smd 2.6 x 1.2: 1 -1,7.5; 2 11,2.5; 4 -1,2.5; 8 11,7.5; C -1,5
TBL009-500-02GY-2GY = drill 1.1 pad 2.54 octagon: 1.1 3,2.6; 1.2 3,7.6; 2.1 8,2.6; 2.2 8,7.6

### Placement (x,y rotation side)
C1  1.91,53.34 90 top
C2  5.08,32.7 270 top
C3  10.79,53.34 90 top
C4  13.97,32.7 270 top
C5  19.68,53.34 90 top
C6  22.86,32.7 270 top
C7  28.57,53.34 90 top
C8  31.75,32.7 270 top
C9  39.37,53.34 90 top
C10  42.55,32.7 270 top
C11  48.58,53.34 90 top
C12  51.75,32.7 270 top
C13  57.47,53.34 90 top
C14  60.64,32.7 270 top
C15  66.67,53.34 90 top
C16  69.85,32.7 270 top
C17  5.08,4.45 0 top
C18  27.62,19.05 270 top
C19  39.69,19.05 270 top
C20  23.81,15.24 180 top
C21  70.8,8.57 0 top
C22  4.45,15.24 90 top
C23  34.92,5.71 270 top
D1  7.3,52.39 270 top
D2  3.49,48.26 0 top
D3  3.49,46.04 180 top
D4  3.49,41.59 0 top
D6  16.19,52.39 270 top
D7  12.38,48.26 0 top
D8  12.38,46.04 180 top
D9  12.38,41.59 0 top
D11  88.27,45.4 90 top
D12  86.68,50.8 90 top
D13  85.09,45.4 90 top
D14  89.85,50.8 90 top
D15  83.5,50.8 90 top
D16  81.92,45.4 90 top
D17  80.33,50.8 90 top
D18  78.74,45.4 90 top
D19  25.08,52.39 270 top
D20  21.27,48.26 0 top
D21  21.27,46.04 180 top
D22  21.27,41.59 0 top
D24  33.97,52.39 270 top
D25  30.16,48.26 0 top
D26  30.16,46.04 180 top
D27  30.16,41.59 0 top
D29  44.77,52.39 270 top
D30  40.96,48.26 0 top
D31  40.96,46.04 180 top
D32  40.96,41.59 0 top
D34  53.98,52.39 270 top
D35  50.16,48.26 0 top
D36  50.16,46.04 180 top
D37  50.16,41.59 0 top
D39  62.87,52.39 270 top
D40  59.05,48.26 0 top
D41  59.05,46.04 180 top
D42  59.05,41.59 0 top
D44  72.07,52.39 270 top
D45  68.26,48.26 0 top
D46  68.26,46.04 180 top
D47  68.26,41.59 0 top
IC1  33.34,19.05 0 top
IC2  45.4,19.05 0 top
IC3  70.8,16.51 90 top
IC5  23.81,11.43 270 top
J1  13.65,5.08 0 top
JP1  34.92,10.79 270 top
JP2  43.81,0.64 180 top
JP3  26.04,0.64 180 top
L1  13.34,60.33 90 top
L2  18.41,60.33 90 top
L3  23.5,60.33 90 top
L4  28.57,60.33 90 top
L5  48.9,60.33 90 top
L6  53.98,60.33 90 top
L7  59.05,60.33 90 top
L8  64.14,60.33 90 top
LED1  96.52,64.77 90 top
LED2  96.52,57.15 90 top
LED3  96.52,49.53 90 top
LED4  96.52,41.91 90 top
LED5  96.52,34.29 90 top
LED6  96.52,26.67 90 top
LED7  96.52,19.05 90 top
LED8  96.52,11.43 90 top
OK1  20.64,25.08 270 top
OK2  58.42,25.08 270 top
Q2  5.08,8.57 90 top
R1  4.13,53.34 90 top
R2  3.49,43.81 180 top
R3  7.3,37.47 90 top
R4  7.3,32.7 90 top
R5  13.02,53.34 90 top
R6  12.38,43.81 180 top
R7  16.19,37.47 90 top
R8  16.19,32.7 90 top
R9  21.91,53.34 90 top
R10  21.27,43.81 180 top
R11  25.08,37.47 90 top
R12  25.08,32.7 90 top
R13  30.8,53.34 90 top
R14  30.16,43.81 180 top
R15  33.97,37.47 90 top
R16  33.97,32.7 90 top
R17  41.59,53.34 90 top
R18  40.96,43.81 180 top
R19  44.77,37.47 90 top
R20  44.77,32.7 90 top
R21  50.8,53.34 90 top
R22  50.16,43.81 180 top
R23  53.98,37.47 90 top
R24  53.98,32.7 90 top
R25  59.69,53.34 90 top
R26  59.05,43.81 180 top
R27  62.87,37.47 90 top
R28  62.87,32.7 90 top
R29  68.9,53.34 90 top
R30  68.26,43.81 180 top
R31  72.07,37.47 90 top
R32  72.07,32.7 90 top
R33  56.83,2.86 90 top
R34  59.05,2.86 90 top
R35  61.28,2.86 90 top
R36  63.5,2.86 90 top
R37  65.72,2.86 90 top
R38  67.94,2.86 90 top
R39  70.17,2.86 90 top
R40  72.39,2.86 90 top
R41  84.14,27.62 180 top
R42  84.14,25.4 180 top
R43  84.14,23.18 180 top
R44  84.14,20.95 180 top
R45  84.14,18.73 180 top
R46  84.14,16.51 180 top
R47  84.14,14.29 180 top
R48  84.14,12.06 180 top
R49  9.53,23.18 180 top
R50  30.8,10.79 180 top
R51  87,37.15 270 top
R52  88.27,33.02 270 top
R53  85.72,33.02 270 top
R54  84.45,37.15 270 top
R55  83.19,33.02 270 top
R56  81.92,37.15 270 top
R57  80.64,33.02 270 top
R58  79.38,37.15 270 top
U1  11.11,15.56 0 top
U$1  3.49,37.47 180 top
U$2  12.38,37.47 180 top
U$3  21.27,37.47 180 top
U$4  30.16,37.47 180 top
U$5  40.96,37.47 180 top
U$6  50.16,37.47 180 top
U$7  59.05,37.47 180 top
U$8  68.26,37.47 180 top
U$19  80.01,65.09 0 top
U$20  80.01,54.93 0 top
X1  11.43,66.67 0 top
X2  21.59,66.67 0 top
X3  44.45,66.67 0 top
X4  54.61,66.67 0 top
X5  33.02,66.67 0 top

### Tracks (layer width: path | path; a pad name or v marks a point on that pad's centre or on a via)
+5V  (via drill 0.25, 0.35)
  Top 0.254: Q2.4 4.13,7.15 C17.1 v2.54,4.45 | 8.26,14.92 7.69,14.36 U1.6 6.75,14.29 C22.1 v2.86,14.29 | 8.26,14.92 8.26,15.56 7.86,15.96 U1.4 | U1.18 14.38,13.56 13.97,13.97 13.97,14.61 | 13.97,14.61 14.52,15.16 U1.20 | 8.26,14.92 8.57,14.61 13.97,14.61 | J1.2 v9.85,7.93 v9.84,7.94 | R49.2 v6.99,23.18 | C20.1 24.77,13.97 25.4,13.34 IC5.8 v28.57,13.34 | v55.24,1.91 R33.1 R34.1 R35.1 R36.1 R37.1 R38.1 R39.1 R40.1 v73.97,1.91 v73.98,1.91 | IC3.20 68.9,10.79 69.85,9.84 C21.1 v68.26,8.57 | IC1.14 29.53,20.64 28.89,20 C18.1 v27.62,21.59 | IC2.14 41.59,20.64 40.95,20 C19.1 v39.69,21.59 | R58.2 79.38,30.48 | 79.38,30.48 v78.42,30.48 | R56.2 81.92,30.48 | 81.92,30.48 80.64,30.48 | 80.64,30.48 79.38,30.48 | R57.2 80.64,30.48 | R55.2 83.19,30.48 | 83.19,30.48 81.92,30.48 | R54.2 84.45,30.48 | 84.45,30.48 83.19,30.48 | R53.2 85.72,30.48 | 85.72,30.48 84.45,30.48 | R51.2 87,30.48 | 87,30.48 85.72,30.48 | R52.2 88.27,30.48 | 88.27,30.48 87,30.48 | 88.27,30.48 v88.9,30.48
  Top 0.406: C23.1 31.43,6.67 JP3.1
  other vias: 0.64,18.41 3.49,23.81 13.34,23.81 18.41,23.81 38.73,25.72 60.01,23.81 74.61,26.35 76.83,37.47 76.83,50.16 77.79,65.09 81.92,76.83 93.34,76.83 99.38,71.75 99.38,62.55 99.38,54.61 99.38,47.31 99.38,39.37 99.38,31.75 99.38,24.13 99.38,15.56 99.38,6.67 93.66,0.64 80.64,0.64 73.03,13.02 59.05,12.7 55.24,8.57 59.37,8.57 61.59,8.57 76.83,8.26 79.38,20.32 42.55,13.97 34.61,13.97 23.81,20 29.84,20 15.24,19.68 7.3,11.43 36.51,6.67
  pour Route15: 0,0 0,24.45 27.3,24.45 29.21,26.35 49.53,26.35 51.44,24.45 71.75,24.45 76.2,28.89 76.2,77.47 100.01,77.47 100.01,0
  pour Route2: 0,0 0,24.45 27.3,24.45 29.21,26.35 49.53,26.35 51.44,24.45 71.75,24.45 76.2,28.89 76.2,77.47 100.01,77.47 100.01,0
ADR  (via drill 0.25)
  Top 0.254: U1.11 9.91,12.63 v9.84,12.7 | U$20.C 77.07,59.93 v76.83,59.69 76.83,69.53 77.39,70.09 U$19.C
  Route2 0.254: v9.84,12.7 8.57,12.7 4.45,16.83 4.45,19.68 6.67,21.91 26.35,21.91 29.53,25.08 49.53,25.08 51.44,23.18 72.39,23.18 77.47,28.26 77.47,59.05 v76.83,59.69
D0  (via drill 0.25)
  Top 0.254: IC3.19 v67.94,12.06 | D14.A 89.85,42.23 88.27,40.64 v88.27,40.01 R52.1 | v19.68,15.24 19.68,16.19 18.73,17.14 17.14,17.14 16.73,17.56 U1.23
  Route2 0.254: v67.94,12.06 68.9,12.06 88.27,31.43 v88.27,40.01
  Bottom 0.254: v67.94,12.06 65.41,14.61 20.32,14.61 v19.68,15.24
D1  (via drill 0.25)
  Top 0.254: IC3.18 v67.94,13.34 | D11.A 88.27,42.23 87,40.96 v87,40.01 R51.1 | v20.64,15.24 20.64,16.51 19.34,17.81 17.21,17.81 16.6,18.41 15.46,18.41 U1.24
  Route2 0.254: v67.94,13.34 69.22,13.34 87,31.11 v87,40.01
  Bottom 0.254: v67.94,13.34 66.04,15.24 v20.64,15.24
D2  (via drill 0.25)
  Top 0.254: IC3.17 v67.94,14.61 | D12.A 86.68,42.23 85.72,41.27 v85.72,40.01 R53.1 | U1.25 13.91,16.99 13.11,16.19 v13.02,16.19
  Route2 0.254: v67.94,14.61 69.53,14.61 85.72,30.8 v85.72,40.01
  Bottom 0.254: v67.94,14.61 66.67,15.88 19.05,15.88 18.41,15.24 16.51,15.24 15.88,15.88 13.34,15.88 v13.02,16.19
D3  (via drill 0.25)
  Top 0.254: IC3.16 v67.94,15.88 | D13.A 85.09,42.23 84.45,41.59 v84.45,40.01 R54.1 | v13.02,17.14 13.11,17.24 U1.26
  Route2 0.254: v67.94,15.88 69.85,15.88 84.45,30.48 v84.45,40.01
  Bottom 0.254: v67.94,15.88 67.31,16.51 18.73,16.51 18.1,15.88 16.83,15.88 16.19,16.51 13.65,16.51 v13.02,17.14
D4  (via drill 0.25)
  Top 0.254: IC3.15 v67.94,17.14 | D15.A 83.5,42.23 83.19,41.91 v83.19,40.01 R55.1 | v12.38,17.78 12.31,17.85 U1.27
  Route2 0.254: v67.94,17.14 70.17,17.14 83.19,30.16 v83.19,40.01
  Bottom 0.254: v67.94,17.14 13.97,17.14 13.34,17.78 v12.38,17.78
D5  (via drill 0.25)
  Top 0.254: IC3.14 v67.94,18.41 | v11.71,18.41 11.51,18.61 U1.28 | D16.A v81.92,40.01 R56.1
  Route2 0.254: v67.94,18.41 70.48,18.41 81.92,29.84 v81.92,40.01
  Bottom 0.254: v11.71,18.41 13.65,18.41 14.29,17.78 67.31,17.78 v67.94,18.41
D6  (via drill 0.25)
  Top 0.254: IC3.13 v67.94,19.68 | D17.A 80.33,42.23 80.64,41.91 v80.64,40.01 R57.1 | v18.41,14.61 18.17,14.36 U1.19
  Route2 0.254: v67.94,19.68 70.8,19.68 80.64,29.53 v80.64,40.01 | v18.41,18.41 v18.41,14.61
  Bottom 0.254: v67.94,19.68 66.67,18.41 v18.41,18.41
D7  (via drill 0.25)
  Top 0.254: IC3.12 v67.94,20.95 | D18.A 78.74,42.23 79.38,41.59 v79.38,40.01 R58.1 | v17.46,16.51 17.14,16.51 16.9,16.76 U1.22
  Route2 0.254: v67.94,20.95 71.12,20.95 79.38,29.21 v79.38,40.01 | v17.46,18.41 v17.46,16.51
  Bottom 0.254: v67.94,20.95 66.04,19.05 18.1,19.05 v17.46,18.41
D+
  Top 0.254: JP3.9 20.95,7.94 25.08,12.06 IC5.7 JP1.1
  Route2 0.254: JP3.9 22.23,5.71 37.47,5.71 JP2.9
D-
  Top 0.254: JP3.10 22.23,5.71 22.23,7.94 25.08,10.79 IC5.6 R50.2
  Route2 0.254: JP3.10 22.23,3.17 37.47,3.17 JP2.10
DIR  (via drill 0.25)
  Top 0.254: IC5.3 IC5.2 v17.78,12.06 | U1.32 8.31,17.85 v8.79,17.37
  Route15 0.254: v8.79,17.37 14.1,12.06 v17.78,12.06
GND  (via drill 0.25)
  other vias: 0.64,23.81 6.03,23.81 14.92,23.81 29.53,25.72 49.21,25.72 53.98,23.81 71.75,23.81 76.83,29.53 76.83,42.55 76.83,56.2 76.83,72.39 76.83,76.83 99.38,76.83 87.63,76.83 99.38,0.64 99.38,12.7 99.38,20.32 99.38,27.94 99.38,35.56 99.38,43.18 99.38,50.8 99.38,58.42 99.38,66.04 87,0.64 73.98,0.64 63.5,0.64 53.98,0.64 15.24,0.64 0.64,0.64 0.64,13.02 70.48,12.06 63.82,20 56.52,20.64 57.47,13.34 66.67,8.57 30.8,12.7 37.47,11.75 37.47,10.16 23.81,12.38 7.3,9.84 7.62,4.45 36.51,4.76 33.34,4.76 87.63,13.02 87.63,15.56 87.63,17.78 87.63,20 87.63,22.23 87.63,24.45 87.63,26.67 80.01,21.27 82.23,56.52 83.5,68.9
  pour Bottom: 0,0 0,24.45 27.3,24.45 29.21,26.35 49.53,26.35 51.44,24.45 71.75,24.45 76.2,28.89 76.2,77.47 100.01,77.47 100.01,0
  pour Top: 0,0 0,24.45 27.3,24.45 29.21,26.35 49.53,26.35 51.44,24.45 71.75,24.45 76.2,28.89 76.2,77.47 100.01,77.47 100.01,0
GND1  (via drill 0.25)
  other vias: 0.95,26.35 6.03,26.35 11.11,26.35 16.83,26.35 21.91,26.35 26.35,26.35 28.26,28.26 35.88,28.26 23.81,30.48 14.92,30.48 32.7,30.48 6.03,30.48 35.88,38.42 35.88,44.45 33.97,48.58 32.07,50.16 35.88,50.16 33.97,52.07 35.88,58.74 29.84,76.52 24.77,76.52 19.68,76.52 14.61,76.52 6.99,76.52 0.64,76.52 0.64,71.12 0.64,64.14 0.64,55.56 3.49,45.72 12.38,45.72 21.27,45.72 30.16,45.72 25.08,48.58 26.99,50.16 23.18,50.16 16.19,48.58 18.1,50.16 14.29,50.16 16.19,52.07 25.08,52.07 7.3,48.58 5.4,50.16 9.21,50.16 7.3,52.07 9.21,38.73 18.1,38.73 26.99,38.73 10.79,55.88 19.68,55.88 28.57,55.88
  pour Route15 (rank 6): 0,25.72 26.67,25.72 28.57,27.62 29.53,27.62 36.51,27.62 36.51,61.91 38.1,63.5 38.1,77.47 0,77.47
  pour Route2 (rank 6): 0,25.72 26.67,25.72 28.57,27.62 29.53,27.62 36.51,27.62 36.51,61.91 38.1,63.5 38.1,77.47 0,77.47
  pour Top (rank 6): 0,25.72 26.67,25.72 28.57,27.62 29.53,27.62 36.51,27.62 36.51,61.91 38.1,63.5 38.1,77.47 0,77.47
  pour Bottom (rank 6): 0,25.72 26.67,25.72 28.57,27.62 29.53,27.62 36.51,27.62 36.51,61.91 38.1,63.5 38.1,77.47 0,77.47
GND2  (via drill 0.25)
  other vias: 38.42,28.26 43.5,28.26 49.85,28.26 52.39,26.35 58.42,26.35 64.45,26.35 70.8,26.35 74.3,29.84 74.3,38.42 70.8,30.48 61.59,30.48 52.7,30.48 43.5,30.48 38.42,32.07 72.07,48.58 72.07,52.07 73.98,50.16 70.17,50.16 74.3,57.47 74.3,65.09 74.3,72.39 74.3,76.52 68.9,76.52 62.87,76.52 57.78,76.52 52.7,76.52 47.62,76.52 38.42,60.96 38.42,55.88 48.58,55.88 57.47,55.88 66.67,55.88 38.42,43.81 46.99,38.42 55.88,38.42 65.09,38.42 62.87,48.58 62.87,52.07 64.77,50.16 60.96,50.16 53.98,48.58 55.88,50.16 52.07,50.16 53.98,52.07 44.77,48.58 46.67,50.16 42.86,50.16 44.77,52.07
  pour Top (rank 6): 37.78,27.62 50.16,27.62 52.07,25.72 71.12,25.72 74.93,29.53 74.93,77.47 39.37,77.47 39.37,62.87 37.78,61.28
  pour Route2 (rank 6): 37.78,27.62 50.16,27.62 52.07,25.72 71.12,25.72 74.93,29.53 74.93,77.47 39.37,77.47 39.37,62.87 37.78,61.28
  pour Route15 (rank 6): 37.78,27.62 50.16,27.62 52.07,25.72 71.12,25.72 74.93,29.53 74.93,77.47 39.37,77.47 39.37,62.87 37.78,61.28
  pour Bottom (rank 6): 37.78,27.62 50.16,27.62 52.07,25.72 71.12,25.72 74.93,29.53 74.93,77.47 39.37,77.47 39.37,62.87 37.78,61.28
IN_/E  (via drill 0.25)
  Top 0.254: v5.4,17.78 5.4,17.71 5.55,17.56 U1.2 | v73.66,10.79 IC3.1
  Bottom 0.254: v5.4,17.78 7.52,17.78 8.54,16.76 11.5,16.76 14.29,13.97 26.67,13.97 29.84,10.79 v73.66,10.79
IN_C  (via drill 0.25)
  Top 0.254: U1.1 5.87,18.36 5.49,18.73 v5.4,18.73 | v65.72,23.81 65.77,23.76 IC3.11
  Route2 0.254: v5.4,18.73 7.3,20.64 22.54,20.64 23.18,21.27 26.35,21.27 26.67,20.95 28.26,20.95 29.21,21.91 29.21,23.5 30.16,24.45 v40.01,24.45
  Route15 0.254: v40.01,24.45 41.59,22.86 64.77,22.86 v65.72,23.81
MISO
  Top 0.254: J1.1 11.11,4.76 12.7,6.35 14.29,6.35 14.61,6.67 14.61,9.53 13.91,10.22 U1.16
MOSI
  Top 0.254: J1.4 13.65,9.21 13.11,9.75 U1.15
N$1
  Top 0.406: D3.A 1.79,44.56 R2.2 1.79,43.06 D4.C
N$2
  Top 0.406: D2.C 5.19,48.08 D3.C
N$3
  Top 0.406: R1.1 C1.1 1.91,48.32 D2.A
N$4
  Top 0.406: D1.C 7.17,54.29 R1.2
  Top 1.016: L1.1 9.11,58.33 7.3,56.52 D1.C
N$5
  Top 0.406: D4.A 4.99,41.39 U$1.1 6.75,38.97 R3.2
N$6
  Top 0.406: R2.1 4.44,43.49 3.49,42.55 3.49,40.96 1.99,39.46 U$1.3
N$7
  Top 0.305: OK1.7 17.46,29.21 17.14,29.53 10.16,29.53 8.57,31.11 8.57,33.02 7.94,33.65 R4.2
  pour Top (no thermals): 0.64,37.47 0.64,32.7 8.89,32.7 8.89,37.47
N$8  (via drill 0.25)
  Top 0.254: OK1.10 v17.46,22.86 | v30.8,23.81 IC1.13 v30.8,20.32 | R33.2 v56.83,5.4
  Route15 0.254: v56.83,5.4 56.83,7.94 45.72,19.05 32.07,19.05 v30.8,20.32
  Bottom 0.254: v30.8,23.81 29.84,22.86 v17.46,22.86
N$9
  Top 1.016: L1.2 13.34,65.09 14.43,66.18 X1.1.1 X1.1.2
N$10
  Top 0.406: D8.A 10.68,44.56 R6.2 10.68,43.06 D9.C
N$11
  Top 0.406: D7.C 14.08,48.08 D8.C
N$12
  Top 0.406: R5.1 C3.1 10.86,52.33 D7.A
N$13
  Top 0.406: D6.C 16.07,54.29 R5.2
  Top 1.016: L2.1 16.73,58.33 16.19,57.78 D6.C
N$14
  Top 0.406: U$2.3 10.88,39.46 12.38,40.96 12.38,42.55 13.33,43.49 R6.1
N$15
  Top 1.016: L2.2 18.41,65.09 19.43,66.1 X1.2.1 X1.2.2
N$16
  Top 0.406: D9.A 13.88,41.39 U$2.1 15.64,38.97 R7.2
N$17
  Top 0.305: OK1.5 20,29.21 17.46,31.75 17.46,33.02 16.83,33.65 R8.2
  pour Top (no thermals): 9.53,37.47 9.53,32.7 17.78,32.7 17.78,37.47
N$18  (via drill 0.25)
  Top 0.254: OK1.12 v20,23.5 | v33.34,23.81 IC1.11 v33.34,20.32 | R34.2 v59.05,5.4
  Route15 0.254: v59.05,5.4 59.05,6.67 46.04,19.68 33.97,19.68 v33.34,20.32
  Bottom 0.254: v20,23.5 29.21,23.5 30.16,24.45 32.7,24.45 v33.34,23.81
N$19
  Top 0.406: D22.C 19.57,43.06 R10.2 19.57,44.56 D21.A
N$20
  Top 0.406: D21.C 22.97,48.08 D20.C
N$21
  Top 0.406: R9.1 C5.1 19.75,52.33 D20.A
N$22
  Top 0.406: D19.C 24.95,54.29 R9.2
  Top 1.016: D19.C 25.08,56.74 L3.1
N$23
  Top 0.406: U$3.3 19.77,39.46 21.27,40.96 21.27,42.55 22.22,43.49 R10.1
N$24
  Top 1.016: L3.2 23.5,65.09 24.59,66.18 X2.1.1 X2.1.2
N$25
  Top 0.406: R11.2 24.53,38.97 U$3.1 22.77,41.39 D22.A
N$26
  Top 0.305: OK1.3 22.54,28.89 21.59,29.84 21.59,32.7 22.54,33.65 C6.1
  pour Top (no thermals): 18.41,37.47 18.41,32.7 26.67,32.7 26.67,37.47
N$27  (via drill 0.25)
  Top 0.254: R35.2 v61.28,5.4 | v35.88,20.32 IC1.9 v35.88,23.81 | OK1.14 v22.54,24.13
  Route15 0.254: v35.88,20.32 46.35,20.32 v61.28,5.4
  Bottom 0.254: v22.54,24.13 28.89,24.13 29.84,25.08 34.61,25.08 v35.88,23.81
N$28
  Top 0.406: D26.A 28.46,44.56 R14.2 28.46,43.06 D27.C
N$29
  Top 0.406: D25.C 31.69,46.21 D26.C
N$30
  Top 0.406: R13.1 C7.1 28.57,48.32 D25.A
N$31
  Top 0.406: D24.C 33.84,54.29 R13.2
  Top 1.016: L4.1 32.16,58.33 33.97,56.52 D24.C
N$32
  Top 0.406: R14.1 31.11,43.49 30.16,42.55 30.16,40.96 28.66,39.46 U$4.3
N$33
  Top 1.016: L4.2 28.57,65.09 29.59,66.1 X2.2.1 X2.2.2
N$34
  Top 0.406: D27.A 31.66,41.39 U$4.1 33.42,38.97 R15.2
N$35
  Top 0.305: OK1.1 25.08,29.21 25.4,29.53 28.57,29.53 30.48,31.43 30.48,33.02 31.11,33.65 C8.1
  pour Top (no thermals): 27.3,37.47 27.3,32.7 35.56,32.7 35.56,37.47
N$36  (via drill 0.25)
  Top 0.254: R36.2 v63.5,5.4 | v29.53,13.34 IC1.1 | OK1.16 v25.08,20.64
  Route2 0.254: v54.29,13.34 v50.48,13.34
  Route15 0.254: v63.5,5.4 55.56,13.34 v54.29,13.34 | v50.48,13.34 v29.53,13.34 29.53,16.19 v25.08,20.64
N$37
  Top 0.406: D31.A 39.26,44.56 R18.2 39.26,43.06 D32.C
N$38
  Top 0.406: D30.C 42.66,48.08 D31.C
N$39
  Top 0.406: R17.1 C9.1 39.43,52.33 D30.A
N$40
  Top 0.406: D29.C 41.72,54.42 R17.2
  Top 1.016: L5.1 46.26,58.33 44.77,56.83 D29.C
N$41
  Top 0.406: U$5.3 39.46,39.46 40.96,40.96 40.96,42.55 41.91,43.49 R18.1
N$42
  Top 1.016: L5.2 48.9,64.77 47.45,66.22 X3.1.1 X3.1.2
N$43
  Top 0.406: D32.A 42.46,41.39 U$5.1 44.22,38.97 R19.2
N$44
  Top 0.406: OK2.7 55.24,29.21 54.93,29.53 47.94,29.53 46.04,31.43 46.04,33.02 45.41,33.65 R20.2
  pour Top (no thermals): 38.42,37.47 38.42,32.7 46.67,32.7 46.67,37.47
N$45  (via drill 0.25)
  Top 0.254: OK2.10 v55.24,20.64 60.96,14.92 60.96,10.16 65.72,5.4 R37.2 | v32.07,20.32 IC1.3
  Bottom 0.254: v55.24,20.64 37.78,20.64 37.15,21.27 32.38,21.27 32.07,20.95 v32.07,20.32
N$46
  Top 0.406: D37.C 48.47,43.06 R22.2 48.47,44.56 D36.A
N$47
  Top 0.406: D36.C 51.87,48.08 D35.C
N$48
  Top 0.406: D35.A 48.64,52.33 C11.1 R21.1
N$49
  Top 0.406: R21.2 50.93,54.42 D34.C
  Top 1.016: L6.1 D34.C
N$50
  Top 0.406: U$6.3 48.66,39.46 50.16,40.96 50.16,42.55 51.12,43.49 R22.1
N$51
  Top 1.016: L6.2 53.98,64.77 52.45,66.3 X3.2.1 X3.2.2
N$52
  Top 0.406: R23.2 53.42,38.97 U$6.1 51.66,41.39 D37.A
N$53
  Top 0.406: OK2.5 57.78,29.21 55.24,31.75 55.24,33.02 54.61,33.65 R24.2
  pour Top (no thermals): 47.31,37.47 47.31,32.7 55.56,32.7 55.56,37.47
N$54  (via drill 0.25)
  Top 0.254: OK2.12 v57.78,20.64 61.59,16.83 61.59,10.48 66.67,5.4 67.94,5.4 R38.2 | v34.61,20.32 IC1.5
  Bottom 0.254: v57.78,20.64 57.15,20 36.83,20 36.51,19.68 35.24,19.68 v34.61,20.32
N$55
  Top 0.406: D41.A 57.35,44.56 R26.2 57.35,43.06 D42.C
N$56
  Top 0.406: D40.C 60.76,48.08 D41.C
N$57
  Top 0.406: R25.1 C13.1 57.47,48.32 D40.A
N$58
  Top 0.406: D39.C 59.82,54.42 R25.2
  Top 1.016: L7.1 60.74,58.33 62.87,56.2 D39.C
N$59
  Top 0.406: U$7.3 57.55,39.46 59.05,40.96 59.05,42.55 60.01,43.49 R26.1
N$60
  Top 1.016: L7.2 59.05,64.77 57.61,66.22 X4.1.1 X4.1.2
N$61
  Top 0.406: D42.A 60.55,41.39 U$7.1 62.31,38.97 R27.2
N$62
  Top 0.406: OK2.3 60.33,29.21 59.37,30.16 59.37,32.7 60.32,33.65 C14.1
  pour Top (no thermals): 56.2,37.47 56.2,32.7 64.45,32.7 64.45,37.47
N$63  (via drill 0.25)
  Top 0.254: OK2.14 v60.33,20.64 62.23,18.73 62.23,10.79 66.67,6.35 69.22,6.35 70.17,5.4 R39.2 | v45.4,23.81 IC2.11
  Bottom 0.254: v60.33,20.64 59.37,21.59 46.04,21.59 45.4,22.23 v45.4,23.81
N$64
  Top 0.406: D47.C 66.56,43.06 R30.2 66.56,44.56 D46.A
N$65
  Top 0.406: D46.C 69.96,48.08 D45.C
N$66
  Top 0.406: D45.A 66.74,52.33 C15.1 R29.1
N$67
  Top 0.406: D44.C 69.03,54.42 R29.2
  Top 1.016: L8.1 70.9,58.33 72.07,57.15 D44.C
N$68
  Top 0.406: U$8.3 66.76,39.46 68.26,40.96 68.26,42.55 69.21,43.49 R30.1
N$69
  Top 1.016: L8.2 64.14,64.77 62.61,66.3 X4.2.1 X4.2.2
N$70
  Top 0.406: R31.2 71.52,38.97 U$8.1 69.76,41.39 D47.A
N$71
  Top 0.406: OK2.1 66.42,28.32 68.58,30.48 68.58,32.7 69.53,33.65 C16.1
  pour Top (no thermals): 65.41,37.47 65.41,32.7 73.66,32.7 73.66,37.47
N$72  (via drill 0.25)
  Top 0.254: OK2.16 v62.87,20.64 62.87,11.11 66.99,6.99 70.8,6.99 72.39,5.4 R40.2 | v42.86,24.45 IC2.13
  Bottom 0.254: v62.87,20.64 61.28,22.23 48.26,22.23 46.04,24.45 v42.86,24.45
N$73  (via drill 0.25)
  Top 0.254: IC3.2 v79.69,12.06 R48.2 | IC1.12 v32.07,23.81
  Route2 0.254: v32.07,23.81 32.7,23.18 32.7,16.51 33.97,15.24 37.78,15.24 41.91,11.11 52.07,11.11 53.98,9.21 70.48,9.21 70.8,8.89 77.79,8.89 79.69,10.79 v79.69,12.06
N$74  (via drill 0.25)
  Top 0.254: IC3.3 v79.06,13.34 80.64,13.34 81.6,14.29 R47.2 | IC1.10 v34.61,23.81
  Route2 0.254: v34.61,23.81 35.24,23.18 35.24,17.46 36.83,15.88 38.1,15.88 42.23,11.75 52.39,11.75 54.29,9.84 70.8,9.84 71.12,9.53 77.47,9.53 79.06,11.11 v79.06,13.34
N$75  (via drill 0.25)
  Top 0.254: IC3.4 v78.42,14.61 80.01,14.61 81.92,16.51 R46.2 | IC1.8 37.88,22.12 v38.1,21.91
  Route2 0.254: v38.1,21.91 38.1,16.83 42.55,12.38 52.7,12.38 54.61,10.48 71.12,10.48 71.44,10.16 77.47,10.16 78.42,11.11 v78.42,14.61
N$76  (via drill 0.25)
  Top 0.254: IC3.5 79.06,15.88 v81.6,18.41 81.92,18.73 R45.2 | IC1.2 v30.8,13.97
  Route2 0.254: v30.8,13.97 31.43,13.34 36.83,13.34 40.96,9.21 51.12,9.21 53.98,6.35 78.11,6.35 81.6,9.84 v81.6,18.41
N$77  (via drill 0.25)
  Top 0.254: IC3.6 79.06,17.14 v80.33,18.41 82.87,20.95 R44.2 | IC1.4 v33.34,13.97
  Route2 0.254: v33.34,13.97 33.97,14.61 37.47,14.61 41.59,10.48 51.75,10.48 54.61,7.62 77.47,7.62 80.33,10.48 v80.33,18.41
N$78  (via drill 0.25)
  Top 0.254: IC3.7 79.38,18.41 v80.96,20 80.96,22.23 81.92,23.18 R43.2 | IC1.6 v35.88,13.97
  Route2 0.254: v35.88,13.97 37.15,13.97 41.27,9.84 51.44,9.84 54.29,6.99 77.79,6.99 80.96,10.16 v80.96,20
N$79  (via drill 0.25)
  Top 0.254: R42.2 81.92,25.4 80.33,23.81 80.33,22.86 77.15,19.68 IC3.8 71.12,19.68 v69.22,21.59 | IC2.10 46.67,23.5 46.99,23.81 v47.94,23.81
  Route2 0.254: v47.94,23.81 48.9,23.81 51.12,21.59 v69.22,21.59
N$80  (via drill 0.25)
  Top 0.254: R41.2 81.92,27.62 79.69,25.4 79.69,23.18 77.47,20.95 IC3.9 71.12,20.95 v70.48,21.59 | IC2.12 v44.13,23.81
  Route2 0.254: v44.13,23.81 44.77,24.45 49.21,24.45 51.44,22.23 69.85,22.23 v70.48,21.59
N$81
  Top 0.254: R48.1 87.63,12.06 89.53,10.16 LED8.A
N$82
  Top 0.254: R47.1 93.03,14.29 LED7.A
N$83
  Top 0.254: R46.1 92.39,16.51 94.61,18.73 94.61,23.5 LED6.A
N$84
  Top 0.254: R45.1 92.08,18.73 93.98,20.64 93.98,30.48 LED5.A
N$85
  Top 0.254: R44.1 91.44,20.95 93.34,22.86 93.34,37.47 LED4.A
N$86
  Top 0.254: R43.1 90.81,23.18 92.71,25.08 92.71,41.59 96.52,45.4 LED3.A
N$87
  Top 0.254: R42.1 90.17,25.4 92.08,27.3 92.08,48.26 96.52,52.7 LED2.A
N$88
  Top 0.254: R41.1 89.53,27.62 91.44,29.53 91.44,50.48 94.93,53.98 94.93,61.91 LED1.A
N$97
  Top 0.254: Q2.3 3.98,11.6 5.94,13.56 U1.7
N$99
  Top 0.254: R50.1 33.02,9.53 JP1.2
N$100
  Top 0.254: D14.C 89.85,53.34 88.27,54.93 88.27,67.94 83.82,72.39 79.21,72.39 U$19.1
N$101  (via drill 0.25)
  Top 0.254: D11.C v88.27,48.58 | v88.92,67.63 90.97,67.63 U$19.2
  Route15 0.254: v88.27,48.58 88.27,55.56 87.63,56.2 87.63,66.33 v88.92,67.63
N$102
  Top 0.254: D12.C 86.68,62.87 81.92,67.63 79.05,67.63 U$19.4
N$103  (via drill 0.25)
  Top 0.254: D13.C v85.09,48.58 | v88.27,72.39 88.46,72.59 U$19.8
  Route15 0.254: v85.09,48.58 85.09,69.22 v88.27,72.39
N$104
  Top 0.254: D15.C 83.5,60.64 81.72,62.43 U$20.1
N$105  (via drill 0.25)
  Top 0.254: D16.C v81.92,48.58 | v88.92,57.47 90.97,57.47 U$20.2
  Route2 0.254: v81.92,48.58 81.92,53.02 86.36,57.47 v88.92,57.47
N$106
  Top 0.254: D17.C 80.33,54.61 79.01,55.93 U$20.4
N$107  (via drill 0.25)
  Top 0.254: D18.C v78.74,48.58 | U$20.8 89.04,62.43 v88.92,62.55
  Route2 0.254: v78.74,48.58 78.74,55.88 85.41,62.55 v88.92,62.55
RESET  (via drill 0.25)
  Top 0.254: U1.29 v10.71,21.27 10.71,22.94 R49.1 | v16.19,3.81 J1.5
  Route15 0.254: v10.71,21.27 7.94,18.5 7.94,17.14 16.19,8.89 v16.19,3.81
RXD  (via drill 0.25)
  Top 0.254: v10.27,17.89 9.91,18.25 U1.30 | IC5.1 v18.73,13.34
  Route15 0.254: v18.73,13.34 17.46,14.61 13.56,14.61 v10.27,17.89
SCK
  Top 0.254: J1.3 13.65,4.76 15.24,6.35 15.24,12.59 U1.17
TXD  (via drill 0.25)
  Top 0.254: v9.21,18.1 9.11,18.19 U1.31 | IC5.4 v18.73,9.53
  Route15 0.254: v9.21,18.1 14.29,13.02 17.78,13.02 18.73,12.06 v18.73,9.53

### Text on the board
Top: SynPLC / DI8-2 V1.0 / 05.07.20 / Marco Müller
Aktuelles_Bauteil: BST-Plan für die Bauteile mit Value: SPT2.5/2-H-5.0_SPT2_[] (Anzahl: 5 / n.b.: 0) | vorne | vorne | vorne | vorne | vorne